# EAGLE design Schematic (EAGLE 9.5.2)
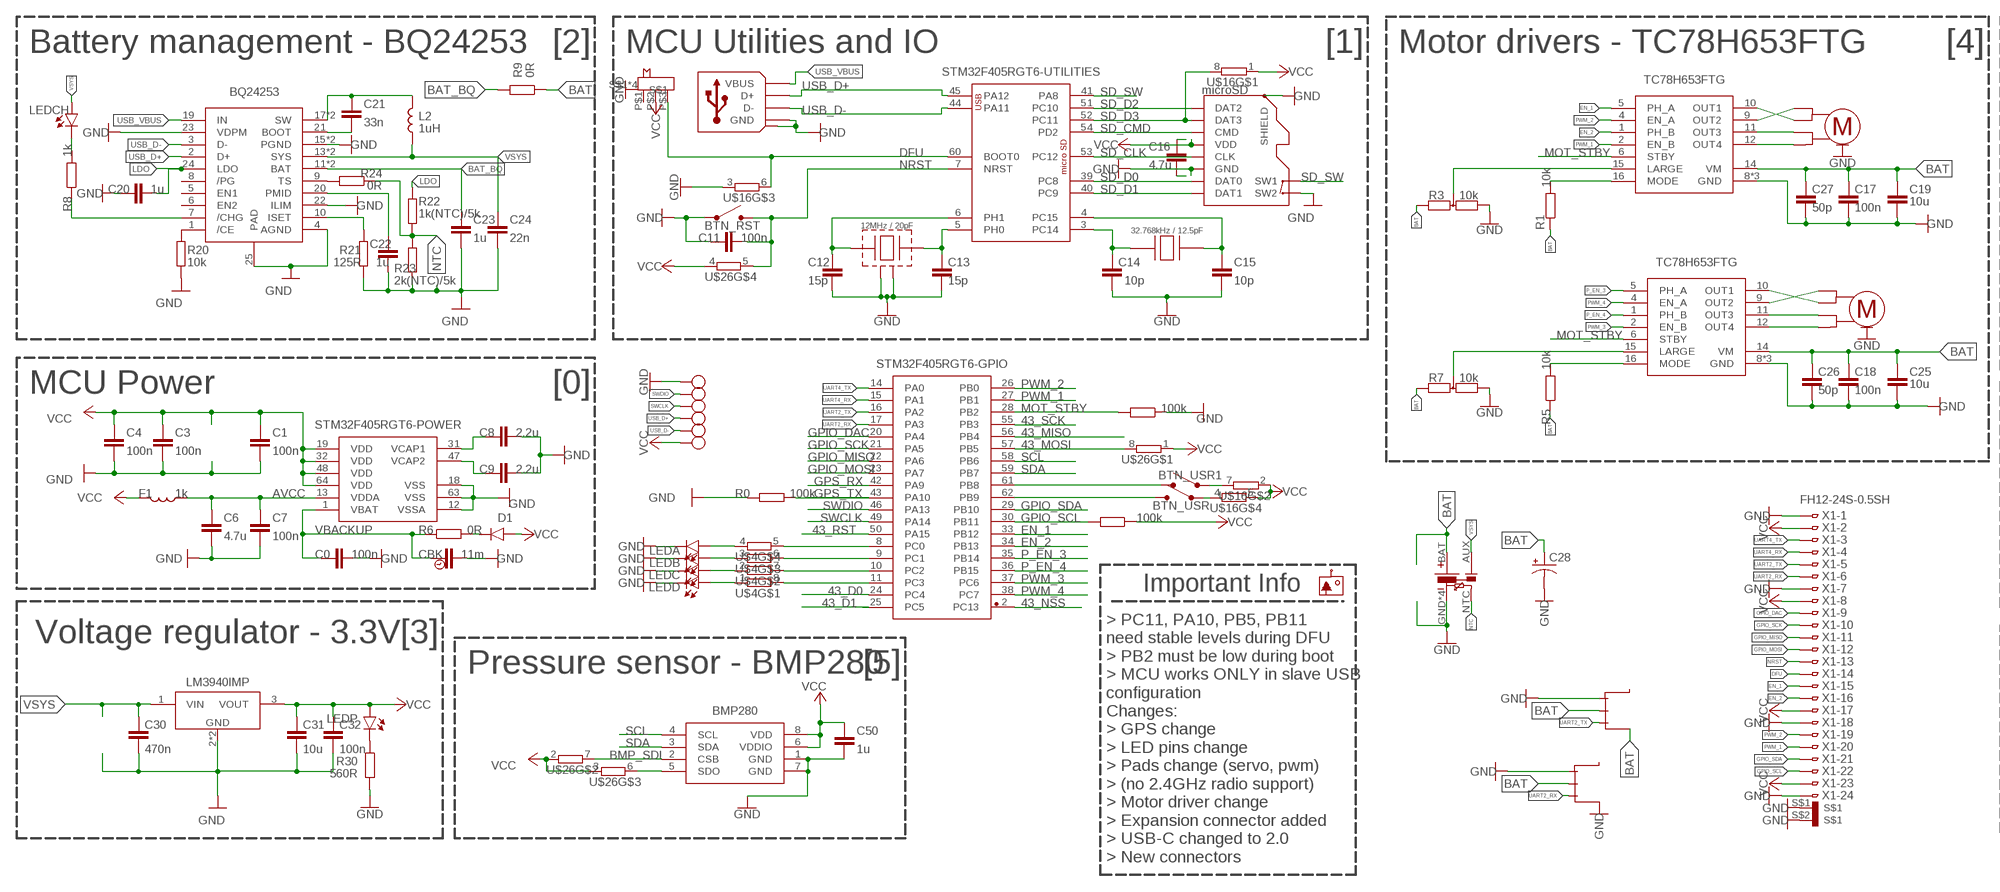
[diagram p0: schematic, sheet 1, part 1 of 2]
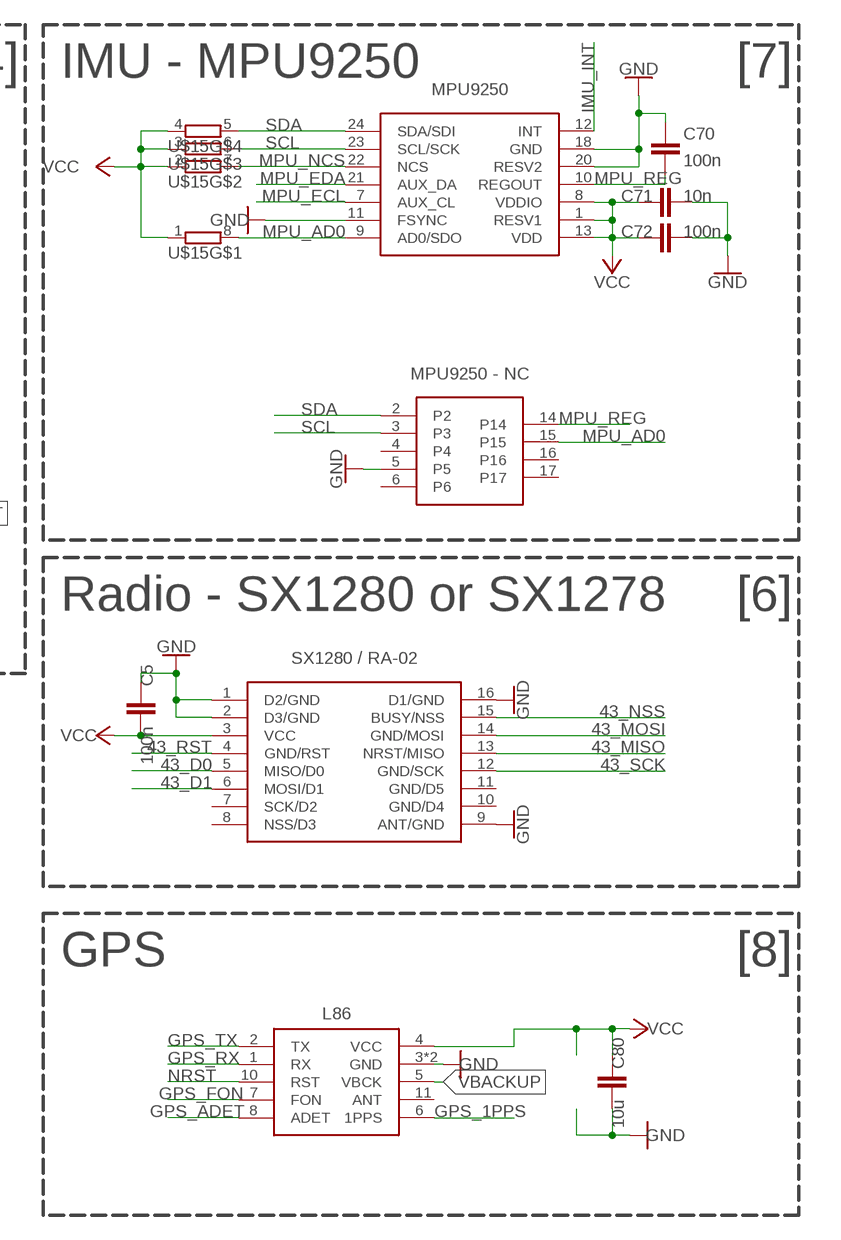
[diagram p1: schematic, sheet 1, part 2 of 2]

## Parts
BTN_DFU  SLIDE-SWITCH2  [SLIDE-SWITCH-2]
BTN_RST  PUSH-SWITCH  [SWITCH_SMD]
BTN_USR  PUSH-SWITCH  [SWITCH_SMD]
BTN_USR1  PUSH-SWITCH  [SWITCH_SMD]
C0  100n  CAPACITOR0603  [C0603]
C1  100n  CAPACITOR0603  [C0603]
C3  100n  CAPACITOR0603  [C0603]
C4  100n  CAPACITOR0603  [C0603]
C5  100n  CAPACITOR0603  [C0603]
C6  4.7u  CAPACITOR0603  [C0603]
C7  100n  CAPACITOR0603  [C0603]
C8  2.2u  CAPACITOR0603  [C0603]
C9  2.2u  CAPACITOR0603  [C0603]
C11  100n  CAPACITOR0603  [C0603]
C12  15p  CAPACITOR0603  [C0603]
C13  15p  CAPACITOR0603  [C0603]
C14  10p  CAPACITOR0603  [C0603]
C15  10p  CAPACITOR0603  [C0603]
C16  4.7u  CAPACITOR0603  [C0603]
C17  100n  CAPACITOR0603  [C0603]
C18  100n  CAPACITOR0603  [C0603]
C19  10u  CAPACITOR1206  [C1206]
C20  1u  CAPACITOR0603  [C0603]
C21  33n  CAPACITOR0603  [C0603]
C22  1u  CAPACITOR0603  [C0603]
C23  1u  CAPACITOR0603  [C0603]
C24  22n  CAPACITOR0603  [C0603]
C25  10u  CAPACITOR1206  [C1206]
C26  50p  CAPACITOR0603  [C0603]
C27  50p  CAPACITOR0603  [C0603]
C28  CPOL-US153CLV-0405  [153CLV-0405]
C30  470n  CAPACITOR0603  [C0603]
C31  10u  CAPACITOR1206  [C1206]
C32  100n  CAPACITOR0603  [C0603]
C50  1u  CAPACITOR0603  [C0603]
C70  100n  CAPACITOR0603  [C0603]
C71  10n  CAPACITOR0603  [C0603]
C72  100n  CAPACITOR0603  [C0603]
C80  10u  CAPACITOR0603  [C0603]
CBK  11m  SUPCAP  [CPH3225A]
D1  DIODE  [R0603]
F1  1k  INDUCTOR0603  [R0603]
L2  1uH  INDUCTOR  [INDUCTOR_VISHAY]
LEDA  LED0805  [CHIPLED_0805]
LEDB  LED0805  [CHIPLED_0805]
LEDC  LED0805  [CHIPLED_0805]
LEDCH  LED0805  [CHIPLED_0805]
LEDD  LED0805  [CHIPLED_0805]
LEDP  LED0805  [CHIPLED_0805]
LM3940IMP  REGULATOR  [SOT230P700X180-4N]
R0  100k  RESISTOR0603  [R0603]
R1  10k  RESISTOR0603  [R0603]
R2  100k  RESISTOR0603  [R0603]
R3  10k  DOUBLE_RESISTOR  [DR0603]
R4  100k  RESISTOR0603  [R0603]
R5  10k  RESISTOR0603  [R0603]
R6  0R  RESISTOR0603  [R0603]
R7  10k  DOUBLE_RESISTOR  [DR0603]
R8  1k  RESISTOR0603  [R0603]
R9  0R  RESISTOR0603  [R0603]
R20  10k  RESISTOR0603  [R0603]
R21  125R  RESISTOR0603  [R0603]
R22  1k(NTC)/5k  RESISTOR0603  [R0603]
R23  2k(NTC)/5k  RESISTOR0603  [R0603]
R24  0R  RESISTOR0603  [R0603]
R30  560R  RESISTOR0603  [R0603]
U$1  STM32F405RGT6  [QFP50P1200X1200X160-64N]
U$2  MICROSD_HOLDER  [MICROSD_HOLDER]
U$3  L86  [L86]
U$4  RESISTORARRAY  [0603-ARC]
U$5  32.768kHz / 12.5pF  OSCILLATOR_2PIN32X15  [OSC32X15]
U$6  12MHz / 20pF  OSCILLATOR_4PIN32X25  [OSCCC320X250X80N]
U$7  USB2.0  [USB-C(2)]
U$8  BMP280  [BMP280]
U$9  MPU9250USR  [MPU9250]
U$10  BQ24253  [QFN50P400X400X100-25T270N]
U$11  TC78H653FTG  [QFN50P300X300X90-17T170N]
U$12  TC78H653FTG  [QFN50P300X300X90-17T170N]
U$13  MOTOR_DUO  [4(2)X_JSTSMD_F]
U$14  BAT_JST_4(3)  [4(3)X_JSTSMD_F]
U$15  RESISTORARRAY  [0603-ARC]
U$16  RESISTORARRAY  [0603-ARC]
U$17  MOTOR_DUO  [4(2)X_JSTSMD_F]
U$18  LOGOSQSM  [LOGOSQSM]
U$19  CONNECTOR_F_X3_JST_SMD  [3X_JSTSMD_F]
U$20  CONNECTOR_F_X3_JST_SMD  [3X_JSTSMD_F]
U$21  LORADUO  [MODULE_SX1280]
U$25  GPIO_DEBUG  [GPIO_DEBUG]
U$26  RESISTORARRAY  [0603-ARC]
X1  FH12-24S-0.5SH  [FH12-24S-0.5SH]

## Nets
43_D0: U$1.24(STM32F405RGT6_GPIO:PC4) U$21.5(MISO/D0)
43_D1: U$1.25(STM32F405RGT6_GPIO:PC5) U$21.6(MOSI/D1)
43_MISO: U$1.56(STM32F405RGT6_GPIO:PB4) U$21.13(NRST/MISO)
43_MOSI: U$1.57(STM32F405RGT6_GPIO:PB5) U$21.14(GND/MOSI) U$26.8
43_NSS: U$1.2(STM32F405RGT6_GPIO:PC13) U$21.15(BUSY/NSS)
43_RST: U$1.50(STM32F405RGT6_GPIO:PA15) U$21.4(GND/RST)
43_SCK: U$1.55(STM32F405RGT6_GPIO:PB3) U$21.12(GND/SCK)
AVCC: C6.1 C7.1 F1.2 U$1.13(STM32F405RGT6_PWR:VDDA)
BAT: C17.1 C18.1 C19.1 C25.1 C26.1 C27.1 C28.+ R1.1 R3.2 R5.1 R7.2 R9.1 U$11.14(VM) U$12.14(VM) U$14.BAT(+) U$19.P$2 U$19.S$1 U$19.S$2(S$1) U$20.P$2
BAT_BQ: C23.1 R9.2 U$10.11(BAT) U$10.12(BAT)
BMP_SDI: U$8.2(CSB) U$26.7
BMP_SDO: U$8.5(SDO) U$26.6
DFU: BTN_DFU.P$3 U$1.60(STM32F405RGT6_UTL:BOOT0) U$16.6 X1.14
EN_1: U$1.33(STM32F405RGT6_GPIO:PB12) U$12.5(PH_A) X1.15
EN_2: U$1.34(STM32F405RGT6_GPIO:PB13) U$12.1(PH_B) X1.16
GND: BTN_DFU.S$1 BTN_DFU.S$2(S$1) BTN_DFU.S$3(S$1) BTN_DFU.S$4(S$1) BTN_RST.P$1 BTN_RST.P$4 C0.2 C1.2 C3.2 C4.2 C5.1 C6.2 C7.2 C8.2 C9.2 C11.1 C12.2 C13.2 C14.2 C15.2 C16.1 C17.2 C18.2 C19.2 C20.1 C22.2 C23.2 C24.2 C25.2 C26.2 C27.2 C28.- C30.2 C31.2 C32.2 C50.2 C70.1 C71.2 C72.2 C80.2 CBK.P$2 LEDA.C LEDB.C LEDC.C LEDD.C LM3940IMP.2(GND) LM3940IMP.4(GND) R0.1 R2.1 R3.3 R7.3 R20.1 R21.1 R23.1 R30.2 U$1.12(STM32F405RGT6_PWR:VSSA) U$1.18(STM32F405RGT6_PWR:VSS) U$1.63(STM32F405RGT6_PWR:VSS) U$2.GND U$2.SHIELD@1(SHIELD) U$2.SHIELD@2(SHIELD) U$2.SHIELD@3(SHIELD) U$2.SHIELD@4(SHIELD) U$2.SW2 U$3.3(GND) U$3.12(GND) U$6.2(GND) U$6.4(GND) U$7.A1(GND) U$7.A12(GND) U$7.B1(GND) U$7.B12(GND) U$7.MID@1(SHIELD) U$7.MID@2(SHIELD) U$7.S$1(GND) U$7.S$2(GND) U$7.S$3(GND) U$7.S$4(GND) U$7.S$5(GND) U$7.S$6(GND) U$7.S$7(GND) U$7.S$8(GND) U$8.1(GND) U$8.7(GND) U$9.5 U$9.11(FSYNC) U$9.18(GND) U$9.20(RESV2) U$10.4(AGND) U$10.15(PGND) U$10.16(PGND) U$10.22(ILIM) U$10.23(VDPM) U$10.25(PAD) U$11.8(GND) U$11.13(GND) U$11.17(GND) U$12.8(GND) U$12.13(GND) U$12.17(GND) U$13.S$1 U$13.S$2(S$1) U$13.S$3(S$1) U$13.S$4(S$1) U$14.GND(-) U$14.S$1(-) U$14.S$2(-) U$14.S$3(-) U$16.3 U$17.S$1 U$17.S$2(S$1) U$17.S$3(S$1) U$17.S$4(S$1) U$19.P$1 U$20.P$1 U$20.S$1 U$20.S$2(S$1) U$21.1(D2/GND) U$21.2(D3/GND) U$21.9(ANT/GND) U$21.16(D1/GND) U$25.P$1 X1.1 X1.7 X1.18 X1.24 X1.S$1 X1.S$2
GPIO_DAC: U$1.20(STM32F405RGT6_GPIO:PA4) X1.9
GPIO_MISO: U$1.22(STM32F405RGT6_GPIO:PA6) X1.11
GPIO_MOSI: U$1.23(STM32F405RGT6_GPIO:PA7) X1.12
GPIO_SCK: U$1.21(STM32F405RGT6_GPIO:PA5) X1.10
GPIO_SCL: R4.2 U$1.30(STM32F405RGT6_GPIO:PB11) X1.22
GPIO_SDA: U$1.29(STM32F405RGT6_GPIO:PB10) X1.21
GPS_1PPS: U$3.6(1PPS)
GPS_ADET: U$3.8(ADET)
GPS_FON: U$3.7(FON)
GPS_RX: U$1.42(STM32F405RGT6_GPIO:PA9) U$3.1(RX)
GPS_TX: R0.2 U$1.43(STM32F405RGT6_GPIO:PA10) U$3.2(TX)
IMU_INT: U$9.12(INT)
LDO: C20.2 R22.2 U$10.24(LDO)
MOT_STBY: R2.2 U$1.28(STM32F405RGT6_GPIO:PB2) U$11.6(STBY) U$12.6(STBY)
MPU_AD0: U$9.9(AD0/SDO) U$9.15 U$15.8
MPU_ECL: U$9.7(AUX_CL)
MPU_EDA: U$9.21(AUX_DA)
MPU_NCS: U$9.22(NCS) U$15.7
MPU_REG: C70.2 U$9.10(REGOUT) U$9.14
N$1: LEDD.A U$4.1
N$2: LEDC.A U$4.2
N$3: LEDCH.C R8.2
N$4: U$11.9(OUT2) U$13.P$1
N$5: BTN_USR.P$2 BTN_USR.P$3 U$1.62(STM32F405RGT6_GPIO:PB9)
N$6: C21.2 U$10.21(BOOT)
N$7: BTN_USR.P$1 BTN_USR.P$4 U$16.4
N$8: C9.1 U$1.47(STM32F405RGT6_PWR:VCAP2)
N$9: C8.1 U$1.31(STM32F405RGT6_PWR:VCAP1)
N$10: R8.1 U$10.7(/CHG)
N$11: C12.1 U$1.6(STM32F405RGT6_UTL:PH1) U$6.1
N$12: C13.1 U$1.5(STM32F405RGT6_UTL:PH0) U$6.3
N$13: C14.1 U$1.3(STM32F405RGT6_UTL:PC14) U$5.P$1
N$14: C15.1 U$1.4(STM32F405RGT6_UTL:PC15) U$5.P$2
N$15: U$1.8(STM32F405RGT6_GPIO:PC0) U$4.5
N$17: R24.2 U$10.9(TS)
N$18: R21.2 U$10.10(ISET)
N$19: U$1.11(STM32F405RGT6_GPIO:PC3) U$4.8
N$20: U$1.10(STM32F405RGT6_GPIO:PC2) U$4.7
N$21: C21.1 L2.P$1 U$10.17(SW) U$10.18(SW)
N$22: LEDP.C R30.1
N$23: U$11.10(OUT1) U$13.P$2
N$24: C22.1 U$10.20(PMID)
N$25: BTN_USR1.P$1 BTN_USR1.P$4 U$16.7
N$26: U$1.9(STM32F405RGT6_GPIO:PC1) U$4.6
N$27: R20.2 U$10.1(/CE)
N$28: BTN_USR1.P$2 BTN_USR1.P$3 U$1.61(STM32F405RGT6_GPIO:PB8)
N$29: U$11.11(OUT3) U$13.P$3
N$30: U$11.12(OUT4) U$13.P$4
N$31: U$12.9(OUT2) U$17.P$1
N$33: U$12.10(OUT1) U$17.P$2
N$34: U$12.11(OUT3) U$17.P$3
N$35: U$12.12(OUT4) U$17.P$4
N$36: R1.2 U$12.16(MODE)
N$37: LEDB.A U$4.3
N$38: LEDA.A U$4.4
N$39: R3.1 U$12.15(LARGE)
N$40: R5.2 U$11.16(MODE)
N$41: D1.2 R6.2
N$42: R7.1 U$11.15(LARGE)
NRST: BTN_RST.P$2 BTN_RST.P$3 C11.2 U$1.7(STM32F405RGT6_UTL:NRST) U$3.10(RST) U$26.5 X1.13
NTC: R22.1 R23.2 R24.1 U$14.NTC
P_EN_3: U$1.35(STM32F405RGT6_GPIO:PB14) U$11.5(PH_A)
P_EN_4: U$1.36(STM32F405RGT6_GPIO:PB15) U$11.1(PH_B)
PWM_1: U$1.27(STM32F405RGT6_GPIO:PB1) U$12.2(EN_B) X1.20
PWM_2: U$1.26(STM32F405RGT6_GPIO:PB0) U$12.4(EN_A) X1.19
PWM_3: U$1.37(STM32F405RGT6_GPIO:PC6) U$11.2(EN_B)
PWM_4: U$1.38(STM32F405RGT6_GPIO:PC7) U$11.4(EN_A)
SCL: U$1.58(STM32F405RGT6_GPIO:PB6) U$8.4(SCL) U$9.3 U$9.23(SCL/SCK) U$15.6
SD_CLK: U$1.53(STM32F405RGT6_UTL:PC12) U$2.CLK
SD_CMD: U$1.54(STM32F405RGT6_UTL:PD2) U$2.CMD
SD_D0: U$1.39(STM32F405RGT6_UTL:PC8) U$2.D0(DAT0)
SD_D1: U$1.40(STM32F405RGT6_UTL:PC9) U$2.D1(DAT1)
SD_D2: U$1.51(STM32F405RGT6_UTL:PC10) U$2.D2(DAT2)
SD_D3: U$1.52(STM32F405RGT6_UTL:PC11) U$2.D3(DAT3) U$16.8
SD_SW: U$1.41(STM32F405RGT6_UTL:PA8) U$2.SW1
SDA: U$1.59(STM32F405RGT6_GPIO:PB7) U$8.3(SDA) U$9.2 U$9.24(SDA/SDI) U$15.5
SWCLK: U$1.49(STM32F405RGT6_GPIO:PA14) U$25.P$3
SWDIO: U$1.46(STM32F405RGT6_GPIO:PA13) U$25.P$2
UART2_RX: U$1.17(STM32F405RGT6_GPIO:PA3) U$20.P$3 X1.6
UART2_TX: U$1.16(STM32F405RGT6_GPIO:PA2) U$19.P$3 X1.5
UART4_RX: U$1.15(STM32F405RGT6_GPIO:PA1) X1.4
UART4_TX: U$1.14(STM32F405RGT6_GPIO:PA0) X1.3
USB_D+: U$1.45(STM32F405RGT6_UTL:PA12) U$7.A6(D+) U$7.B6(D+) U$10.2(D+) U$25.P$4
USB_D-: U$1.44(STM32F405RGT6_UTL:PA11) U$7.A7(D-) U$7.B7(D-) U$10.3(D-) U$25.P$5
USB_VBUS: U$7.A4(VBUS) U$7.A9(VBUS) U$7.B4(VBUS) U$7.B9(VBUS) U$10.19(IN)
VBACKUP: C0.1 CBK.P$1 R6.1 U$1.1(STM32F405RGT6_PWR:VBAT) U$3.5(VBCK)
VCC: BTN_DFU.P$2 C1.1 C3.1 C4.1 C5.2 C16.2 C31.1 C32.1 C50.1 C71.1 C72.1 C80.1 D1.1 F1.1 LEDP.A LM3940IMP.3(VOUT) R4.1 U$1.19(STM32F405RGT6_PWR:VDD) U$1.32(STM32F405RGT6_PWR:VDD) U$1.48(STM32F405RGT6_PWR:VDD) U$1.64(STM32F405RGT6_PWR:VDD) U$2.VCC(VDD) U$3.4(VCC) U$8.6(VDDIO) U$8.8(VDD) U$9.1(RESV1) U$9.8(VDDIO) U$9.13(VDD) U$15.1 U$15.2 U$15.3 U$15.4 U$16.1 U$16.2 U$16.5 U$21.3(VCC) U$25.P$6 U$26.1 U$26.2 U$26.3 U$26.4 X1.2 X1.8 X1.17 X1.23
VSYS: C24.1 C30.1 L2.P$2 LEDCH.A LM3940IMP.1(VIN) U$10.13(SYS) U$10.14(SYS) U$14.AUX(AUX+)
Unconnected: BTN_DFU.P$1 U$3.11(ANT) U$9.4 U$9.6 U$9.16 U$9.17 U$10.5(EN1) U$10.6(EN2) U$10.8(/PG) U$21.7(SCK/D2) U$21.8(NSS/D3) U$21.10(GND/D4) U$21.11(GND/D5)

## Notes on the sheet
- Battery management - BQ24253 | [2] | MCU Utilities and IO | [1] | Motor drivers - TC78H653FTG | [4] | IMU - MPU9250 | [7]
- MCU Power | [0]
- Radio - SX1280 or SX1278 | [6]
- Important Info
- > PC11, PA10, PB5, PB11
  need stable levels during DFU
  > PB2 must be low during boot
  > MCU works ONLY in slave USB
  configuration
- Voltage regulator - 3.3V | [3]
- GPS | [8]
- Pressure sensor - BMP280 | [5]
- Changes:
  > GPS change
  > LED pins change
  > Pads change (servo, pwm)
  > (no 2.4GHz radio support)
  > Motor driver change
  > Expansion connector added
  > USB-C changed to 2.0
  > New connectors

## Library data of the parts
BTN_DFU = SobieskiSat2:SLIDE-SWITCH
BTN_RST BTN_USR BTN_USR1 = SobieskiSat2:PUSH-SWITCH
C0 C1 C3-C9 C11-C27 C30-C32 C50 C70-C72 C80 = Unified:CAPACITOR
C28 = rcl:CPOL-US: POLARIZED CAPACITOR, American symbol; SPICEPREFIX: C
CBK = SobieskiSat2:SUPCAP
D1 = Unified:DIODE
F1 = Unified:INDUCTOR
L2 = SobieskiSat2:INDUCTOR
LEDA LEDB LEDC LEDCH LEDD LEDP = Unified:LED
LM3940IMP = Unified:REGULATOR
R0 R1 R2 R4-R6 R8 R9 R20-R24 R30 = Unified:RESISTOR
R3 R7 = SobieskiSat2:DOUBLE_RESISTOR
U$1 = SobieskiSat2:STM32F405RGT6
U$2 = SobieskiSat2:MICROSD_HOLDER: https://www.molex.com/molex/products/datasheet.jsp?part=active/5033981892_MEMORY_CARD_SOCKET.xml&channel=Products&Lang=en-US
U$3 = SobieskiSat2:L86
U$4 U$15 U$16 U$26 = SobieskiSat2:RESISTORARRAY
U$5 = SobieskiSat2:OSCILLATOR_2PIN
U$6 = SobieskiSat2:OSCILLATOR_4PIN
U$7 = SobieskiSat2:USB
U$8 = SobieskiSat2:BMP280
U$9 = SobieskiSat2:MPU9250
U$10 = SobieskiSat2:BQ24253
U$11 U$12 = SobieskiSat2:TC78H653FTG
U$13 U$17 = SobieskiSat2:MOTOR_DUO
U$14 = SobieskiSat2:BAT_JST_4(3)
U$18 = SobieskiSat2:LOGO
U$19 U$20 = Unified:CONNECTOR_F_X3
U$21 = SobieskiSat2:LORADUO
U$25 = SobieskiSat2:GPIO_DEBUG
X1 = SobieskiSat2:FH12-24S-0.5S: 0.5mm Pitch Connectors For FPC/FFC Source: Data sheet <http://www.hirose.co.jp/cataloge_hp/e58605370.pdf>; MPN: FH12-24S-0.5SH(55); OC_FARNELL: 1324552; OC_NEWARK: 34M6170

## Board
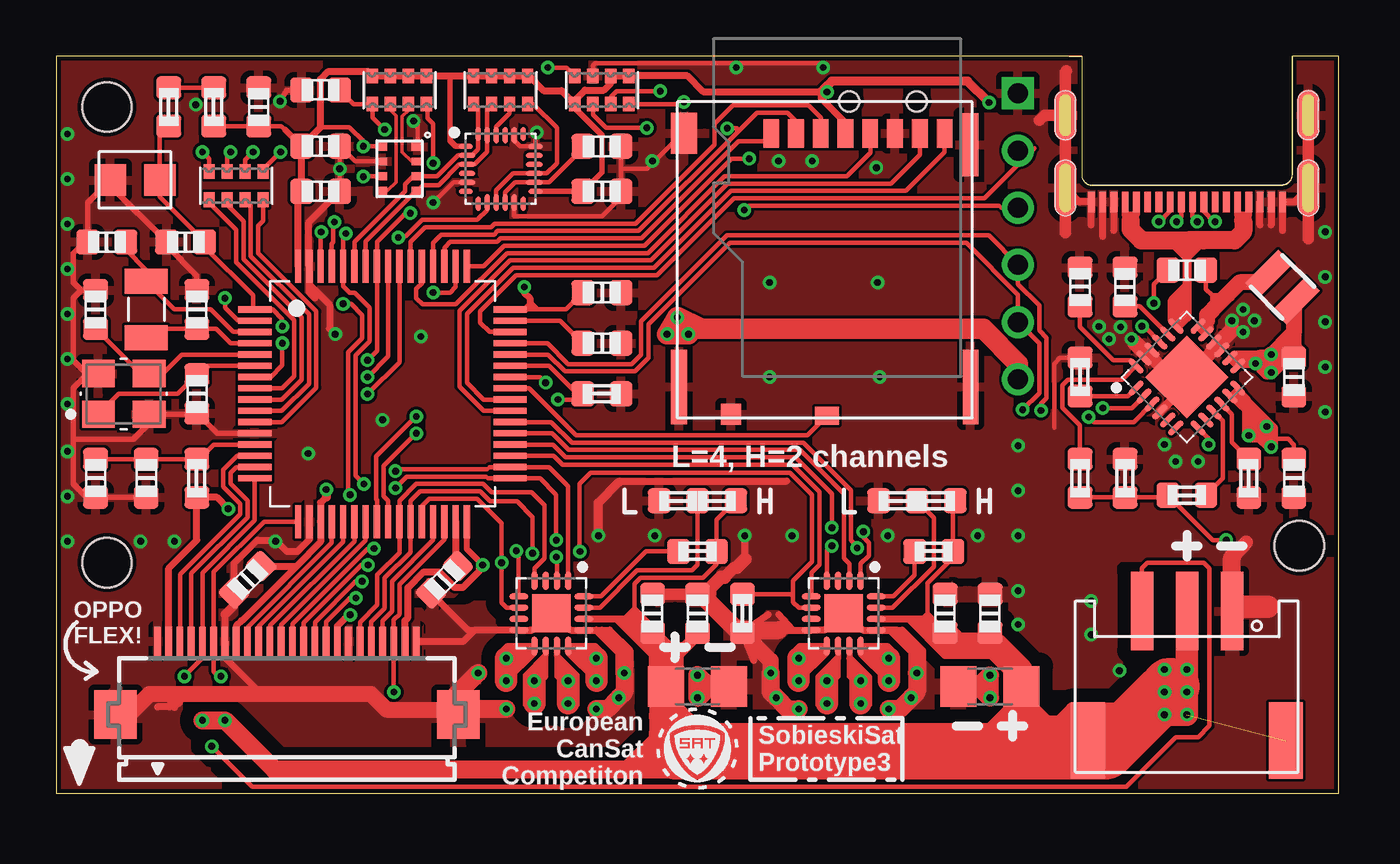
[diagram p2: board, top side]
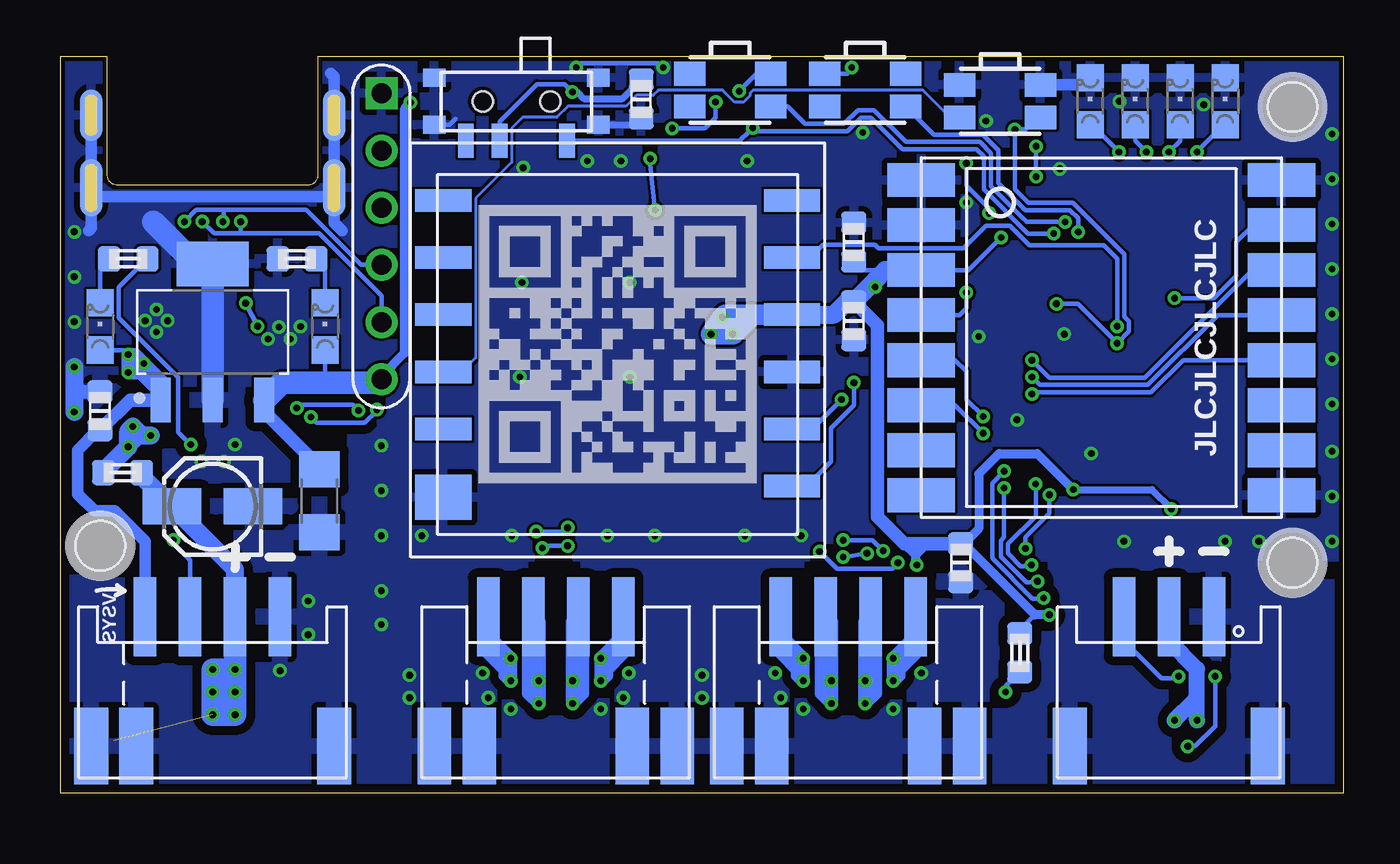
[diagram p3: board, bottom side, seen from below]

Size 57 x 32.75 mm. Coordinates in mm from the lower left corner, seen from the top.
Outline: 54.45,27.02 46,27.02 arc-84 45.58,27.45 45.58,32.75 0,32.75 0,0 57,0 57,32.75 54.92,32.75 54.92,27.48 arc-97 54.45,27.02
Outline: 54.45,27.02 54.48,27.02
Copper layers (1*16): Top 0.035mm / dielectric 1.2mm / Bottom 0.035mm
Design rules "jlcpcb_2layers *": minimum track width 5mil, minimum drill 0.3mm, track to track 5mil, track to pad 5mil, pad to pad 5mil, via to via 5mil, smd to smd 5mil, copper to edge 0.2mm, drill to drill 6mil, minimum pad ring 3mil, minimum via ring 0.15mm, stop-mask expansion 4mil, vias tented up to drill 0.35mm, thermal gap 10mil
Holes 2.2 mm at 2.25,30.5 55.25,11 2.25,10.25
tRestrict: area 2.7,18 to 3.3,19; area 2.7,16.1 to 3.3,17.4; area 48.3,16.6 to 52.2,20.5; area 51.1,19.4 to 52.1,20.4; area 48,19 to 49,20

### Footprints (pad centres in the part's own frame; a part is rotated, then mirrored left to right if it is on the bottom)
SLIDE-SWITCH-2 = smd 0.7 x 1.5: P$1 -2.25,-1.75; P$2 -0.75,-1.75; P$3 2.25,-1.75 | smd 1 x 0.8: S$1 -3.65,1.05; S$2 3.65,1.05; S$3 -3.65,-1.05; S$4 3.65,-1.05 | hole 0.9: -1.5,0; 1.5,0
SWITCH_SMD = smd 1.4 x 1.05: P$1 -1.8,0.725; P$2 -1.8,-0.725; P$3 1.8,-0.725; P$4 1.8,0.725
C0603 = smd 1 x 1.1: 1 -0.85,0; 2 0.85,0
C1206 = smd 1.6 x 1.8: 1 -1.4,0; 2 1.4,0
153CLV-0405 = smd 2.6 x 1.6: + 1.8,0; - -1.8,0
CPH3225A = smd 1.4 x 1.4: P$1 -1.1,0; P$2 1.1,0
R0603 = smd 1 x 1.1: 1 -0.85,0; 2 0.85,0
INDUCTOR_VISHAY = smd 0.9 x 2.1: P$1 -0.85,0; P$2 0.85,0
CHIPLED_0805 = smd 1.2 x 1.2: A 0,-1.05; C 0,1.05
SOT230P700X180-4N = smd 1.965 x 0.889: 1 -3.023,2.3; 2 -3.023,0; 3 -3.023,-2.3 | smd 1.965 x 3.189: 4 3.023,0
DR0603 = smd 1 x 1.1: 1 0,0; 2 1.7,0; 3 -1.7,0
QFP50P1200X1200X160-64N = smd 1.469 x 0.28: 1 -5.671,3.75; 2 -5.671,3.25; 3 -5.671,2.75; 4 -5.671,2.25; 5 -5.671,1.75; 6 -5.671,1.25; 7 -5.671,0.75; 8 -5.671,0.25; 9 -5.671,-0.25; 10 -5.671,-0.75; 11 -5.671,-1.25; 12 -5.671,-1.75; 13 -5.671,-2.25; 14 -5.671,-2.75; 15 -5.671,-3.25; 16 -5.671,-3.75; 33 5.671,-3.75; 34 5.671,-3.25; 35 5.671,-2.75; 36 5.671,-2.25; 37 5.671,-1.75; 38 5.671,-1.25; 39 5.671,-0.75; 40 5.671,-0.25; 41 5.671,0.25; 42 5.671,0.75; 43 5.671,1.25; 44 5.671,1.75; 45 5.671,2.25; 46 5.671,2.75; 47 5.671,3.25; 48 5.671,3.75 | smd 0.28 x 1.469: 17 -3.75,-5.671; 18 -3.25,-5.671; 19 -2.75,-5.671; 20 -2.25,-5.671; 21 -1.75,-5.671; 22 -1.25,-5.671; 23 -0.75,-5.671; 24 -0.25,-5.671; 25 0.25,-5.671; 26 0.75,-5.671; 27 1.25,-5.671; 28 1.75,-5.671; 29 2.25,-5.671; 30 2.75,-5.671; 31 3.25,-5.671; 32 3.75,-5.671; 49 3.75,5.671; 50 3.25,5.671; 51 2.75,5.671; 52 2.25,5.671; 53 1.75,5.671; 54 1.25,5.671; 55 0.75,5.671; 56 0.25,5.671; 57 -0.25,5.671; 58 -0.75,5.671; 59 -1.25,5.671; 60 -1.75,5.671; 61 -2.25,5.671; 62 -2.75,5.671; 63 -3.25,5.671; 64 -3.75,5.671
MICROSD_HOLDER = smd 0.7 x 1.27: CLK 2.02,6; CMD -0.18,6; D0 4.22,6; D1 5.32,6; D2 -2.38,6; D3 -1.28,6; GND 3.12,6; VCC 0.92,6 | smd 0.7 x 3.33: SHIELD@1 6.48,-5.263; SHIELD@3 -6.48,-5.263 | smd 0.86 x 2.8: SHIELD@2 6.4,5.5 | smd 1.14 x 1.83: SHIELD@4 -6.26,6.015 | smd 1.05 x 0.78: SW1 0.095,-6.54 | smd 0.9 x 0.93: SW2 -4.17,-6.465
L86 = smd 2.5 x 1: 1 -7.75,5.85; 2 -7.75,3.31; 3 -7.75,0.77; 4 -7.75,-1.77; 5 -7.75,-4.31; 6 -7.75,-6.85; 7 7.75,-6.85; 8 7.75,-4.31; 9 7.75,-1.77; 10 7.75,0.77; 11 7.75,3.31 | smd 2.5 x 2: 12 7.75,6.35
0603-ARC = smd 0.5 x 0.65: 1 -1.2,-0.625; 2 -0.4,-0.625; 3 0.4,-0.625; 4 1.2,-0.625; 5 1.2,0.625; 6 0.4,0.625; 7 -0.4,0.625; 8 -1.2,0.625
OSC32X15 = smd 1.1 x 1.9: P$1 -1.25,0; P$2 1.25,0
OSCCC320X250X80N = smd 1.462 x 1.212: 1 -1.125,-0.9; 2 1.125,-0.9; 3 1.125,0.9; 4 -1.125,0.9
USB-C(2) = smd 0.3 x 0.9: A1 -3.75,3.85; A4 -2.75,3.85; A5 -1.75,3.85; A6 -0.75,3.85; A7 0.75,3.85; A8 1.75,3.85; A9 2.75,3.85; A12 3.75,3.85; B1 3.25,3.85; B4 2.25,3.85; B5 1.25,3.85; B6 0.25,3.85; B7 -0.25,3.85; B8 -1.25,3.85; B9 -2.25,3.85; B12 -3.25,3.85; MID@1 -4.25,3.85; MID@2 4.25,3.85 | smd 1 x 2.3 bottom: S$1 -5.4,0; S$2 5.4,0 | smd 1 x 2.55 bottom: S$3 -5.4,3.23; S$4 5.4,3.23 | smd 1 x 2.3: S$5 -5.4,0; S$6 5.4,0 | smd 1 x 2.55: S$7 -5.4,3.23; S$8 5.4,3.23
BMP280 = smd 0.5 x 0.35: 1 0.8,0.975; 2 0.8,0.325; 3 0.8,-0.325; 4 0.8,-0.975; 5 -0.8,-0.975; 6 -0.8,-0.325; 7 -0.8,0.325; 8 -0.8,0.975
MPU9250 = smd 0.638 x 0.22: 1 -1.546,1; 6 -1.546,-1; 13 1.546,-1; 18 1.546,1 | smd 0.738 x 0.22: 2 -1.496,0.6; 3 -1.496,0.2; 4 -1.496,-0.2; 5 -1.496,-0.6; 14 1.496,-0.6; 15 1.496,-0.2; 16 1.496,0.2; 17 1.496,0.6 | smd 0.22 x 0.638: 7 -1,-1.546; 12 1,-1.546; 19 1,1.546; 24 -1,1.546 | smd 0.22 x 0.738: 8 -0.6,-1.496; 9 -0.2,-1.496; 10 0.2,-1.496; 11 0.6,-1.496; 20 0.6,1.496; 21 0.2,1.496; 22 -0.2,1.496; 23 -0.6,1.496
QFN50P400X400X100-25T270N = smd 0.84 x 0.264: 1 -1.945,1.25; 2 -1.945,0.75; 3 -1.945,0.25; 4 -1.945,-0.25; 5 -1.945,-0.75; 6 -1.945,-1.25; 13 1.945,-1.25; 14 1.945,-0.75; 15 1.945,-0.25; 16 1.945,0.25; 17 1.945,0.75; 18 1.945,1.25 | smd 0.264 x 0.84: 7 -1.25,-1.945; 8 -0.75,-1.945; 9 -0.25,-1.945; 10 0.25,-1.945; 11 0.75,-1.945; 12 1.25,-1.945; 19 1.25,1.945; 20 0.75,1.945; 21 0.25,1.945; 22 -0.25,1.945; 23 -0.75,1.945; 24 -1.25,1.945 | smd 2.6 x 2.6: 25 0,0
QFN50P300X300X90-17T170N = smd 0.838 x 0.27: 1 -1.446,0.75; 2 -1.446,0.25; 3 -1.446,-0.25; 4 -1.446,-0.75; 9 1.446,-0.75; 10 1.446,-0.25; 11 1.446,0.25; 12 1.446,0.75 | smd 0.27 x 0.838: 5 -0.75,-1.446; 6 -0.25,-1.446; 7 0.25,-1.446; 8 0.75,-1.446; 13 0.75,1.446; 14 0.25,1.446; 15 -0.25,1.446; 16 -0.75,1.446 | smd 1.7 x 1.7: 17 0,0
4(2)X_JSTSMD_F = smd 1 x 3.5: P$1 -3,-3.35; P$2 -1,-3.35; P$3 1,-3.35; P$4 3,-3.35 | smd 1.5 x 3.4: S$1 -3.4,2.4; S$2 3.4,2.4; S$3 -5.4,2.4; S$4 5.4,2.4
4(3)X_JSTSMD_F = smd 1 x 3.5: AUX 3,-3.35; BAT -1,-3.35; GND -3,-3.35; NTC 1,-3.35 | smd 1.5 x 3.4: S$1 -5.4,2.4; S$2 5.4,2.4; S$3 3.4,2.4
3X_JSTSMD_F = smd 1 x 3.5: P$1 -2,-3.35; P$2 0,-3.35; P$3 2,-3.35 | smd 1.5 x 3.4: S$1 -4.4,2.4; S$2 4.4,2.4
MODULE_SX1280 = smd 3 x 1.5: 1 -8,7; 2 -8,5; 3 -8,3; 4 -8,1; 5 -8,-1; 6 -8,-3; 7 -8,-5; 8 -8,-7; 9 8,-7; 10 8,-5; 11 8,-3; 12 8,-1; 13 8,1; 14 8,3; 15 8,5; 16 8,7
GPIO_DEBUG = drill 0.889 pad 1.422 square: P$1 0,6.35 | drill 0.889 pad 1.422: P$2 0,3.81; P$3 0,1.27; P$4 0,-1.27; P$5 0,-3.81; P$6 0,-6.35
FH12-24S-0.5SH = smd 0.3 x 1.3: 1 -5.75,3.25; 2 -5.25,3.25; 3 -4.75,3.25; 4 -4.25,3.25; 5 -3.75,3.25; 6 -3.25,3.25; 7 -2.75,3.25; 8 -2.25,3.25; 9 -1.75,3.25; 10 -1.25,3.25; 11 -0.75,3.25; 12 -0.25,3.25; 13 0.25,3.25; 14 0.75,3.25; 15 1.25,3.25; 16 1.75,3.25; 17 2.25,3.25; 18 2.75,3.25; 19 3.25,3.25; 20 3.75,3.25; 21 4.25,3.25; 22 4.75,3.25; 23 5.25,3.25; 24 5.75,3.25 | smd 1.905 x 2.159: S$1 -7.62,0; S$2 7.62,0

### Placement (x,y rotation side)
BTN_DFU  36.75,30.75 0 bottom
BTN_RST  15.25,30.75 0 bottom
BTN_USR  21.25,31.25 0 bottom
BTN_USR1  27.25,31.25 0 bottom
C0  5.75,24.5 180 top
C1  8.5,9.5 225 top
C3  24.25,22.25 0 top
C4  11.75,26.75 0 top
C5  21.75,21 90 bottom
C6  4,14 270 top
C7  1.75,14 270 top
C8  17.25,9.5 225 top
C9  24.25,20 0 top
C11  11.75,31.25 0 top
C12  6.25,17.75 270 top
C13  1.75,21.5 90 top
C14  2.25,24.5 180 top
C15  6.25,21.5 90 top
C16  31.2,30.85 90 bottom
C17  28.5,8 90 top
C18  41.5,8 90 top
C19  28.5,4.75 0 top
C20  45.5,22.5 270 top
C21  50.25,23.25 180 top
C22  47.5,22.5 90 top
C23  55,14 270 top
C24  55,18.5 270 top
C25  41.5,4.75 180 top
C26  39.5,8 90 top
C27  26.5,8 90 top
C28  50.25,12.75 180 bottom
C30  55.25,17 90 bottom
C31  45.5,13 270 bottom
C32  17,10.25 270 bottom
C50  11.75,28.75 0 top
C70  24.25,28.75 180 top
C71  21.75,24.5 90 bottom
C72  24.25,26.75 0 top
C80  9,30.5 90 top
CBK  3.5,27.25 180 top
D1  7,30.5 90 top
F1  6.25,14 90 top
L2  54.5,22.5 315 top
LEDA  5.25,30.75 0 bottom
LEDB  7.25,30.75 0 bottom
LEDC  9.25,30.75 0 bottom
LEDCH  55.25,20.75 0 bottom
LEDD  11.25,30.75 0 bottom
LEDP  45.25,20.75 0 bottom
LM3940IMP  50.25,20.5 90 bottom
R0  24.25,17.75 180 top
R1  28.5,10.75 180 top
R2  30.5,8 90 top
R3  28.5,13 0 top
R4  14.38,6.25 270 bottom
R5  39,10.75 180 top
R6  5,30.5 90 top
R7  38.25,13 0 top
R8  54,23.75 180 bottom
R9  54.25,14.25 180 bottom
R20  45.5,18.5 270 top
R21  53,14 90 top
R22  45.5,14 90 top
R23  47.5,14 270 top
R24  50.25,13.25 0 top
R30  46.5,23.75 180 bottom
U$1  14.5,17.75 0 top
U$2  34.16,23.32 0 top
U$3  32.25,19.5 180 bottom
U$4  8,27 180 top
U$5  4,21.5 270 top
U$6  3,17.75 0 top
U$7  50.25,30.13 180 top
U$8  15.25,27.75 0 top
U$9  19.75,27.75 0 top
U$10  50.25,18.5 45 top
U$11  35,8 270 top
U$12  22,8 270 top
U$13  35,4.5 180 bottom
U$14  50.25,4.5 180 bottom
U$15  19.75,31.25 180 top
U$16  24.25,31.25 180 top
U$17  22,4.5 180 bottom
U$18  26.5,0 0 top
U$19  50.25,4.75 180 top
U$20  7.75,4.5 180 bottom
U$21  10.75,20.25 0 bottom
U$25  42.75,24.75 0 bottom
U$26  15.25,31.25 180 top
X1  10.25,3.5 0 top

### Tracks (layer width: path | path; a pad name or v marks a point on that pad's centre or on a via)
43_D0  (via drill 0.3)
  Top 0.2: U$1.24 14.25,13.04 14.22,13.06 14.22,14.97 v16,16.75
  Bottom 0.2: v16,16.75 16.75,17.5 16.75,18.75 17.25,19.25 U$21.5
43_D1  (via drill 0.3)
  Top 0.2: U$1.25 14.75,13 14.55,13.2 14.55,14.55 v16,16
  Bottom 0.2: v16,16 17.25,17.25 U$21.6
43_MISO  (via drill 0.3)
  Top 0.2: U$1.56 14.75,19.41 v13.84,18.5
  Bottom 0.2: v13.84,18.5 13.48,18.15 8.68,18.15 5.58,21.25 U$21.13
43_MOSI  (via drill 0.3)
  Top 0.2: v13.84,19.25 14.25,19.66 U$1.57 14.25,24.5 15.53,25.78 v15.73,25.78 | v16.75,28 16.75,29.75 16.5,30 16.5,30.57 U$26.8
  Bottom 0.2: v13.84,19.25 13.06,18.47 8.81,18.47 4.04,23.25 U$21.14 | v16.75,28 16.75,27 15.73,25.98 v15.73,25.78
43_NSS  (via drill 0.3)
  Top 0.2: U$1.2 8.08,21 7.5,21.58 v7.5,22
  Bottom 0.2: v7.5,22 5.75,22 4.75,23 4.75,24.5 4,25.25 U$21.15
43_RST  (via drill 0.3)
  Top 0.2: v16.75,22.25 17.5,22.25 17.75,22.5 U$1.50
  Bottom 0.2: U$21.4 17.05,21.25 16.75,21.55 v16.75,22.25
43_SCK  (via drill 0.3)
  Top 0.2: U$1.55 15.25,19.16 v13.84,17.75
  Bottom 0.2: v13.84,17.75 13.75,17.75 13.68,17.82 8.54,17.82 7.11,19.25 U$21.12
AVCC
  Top 0.2: U$1.13 7,15.5 6.35,14.85 F1.2 C6.1 C7.1
BAT  (via drill 0.3)  (1 unrouted)
  Top 0.2: R3.2 29.35,12.15 R1.1 29.35,10.18 28.75,9.58 25.96,9.58 25.7,9.32 25.7,8.15 25.7,7.75 | R7.2 39.85,12.9 R5.1 39.85,10.47 38.72,9.34 38.72,8 | 25.2,7.75 25.3,7.75 | C18.1 41.75,6.9 41.75,6.65 | 40.6,6.65 39.9,7.35 | 38.75,7.75 38.72,7.78 38.72,7.97 | 38.72,8 39.02,7.7 39.02,7.62 | 38.72,8 38.72,7.97 | 38.72,7.97 38.5,7.75
  Top 0.25: 24.85,7.75 26.45,6.15 26.45,5.1 26.8,4.75 C19.1 27.75,5.4 | 27.7,6.25 27.75,6.2 | 37.85,7.75 39.5,6.1 41.55,6.1 C25.1 | C26.1 38.8,7.15
  Top 0.3: 27.68,6.17 27.75,6.1 27.75,5.4 | 27.68,6.17 27.3,6.55 | 27.3,6.55 26.1,7.75 | U$12.14 24.85,7.75 25.2,7.75 | 25.2,7.75 25.7,7.75 26.1,7.75 | 25.8,7.15 25.2,7.75 | 25.3,7.75 25.7,8.15 26.1,7.75 | U$11.14 37.85,7.75 38.5,7.75 38.75,7.75 38.9,7.75 39.02,7.62 C26.1 | 27.75,6.2 27.73,6.17 27.68,6.17 | 25.9,7.3 26.35,7.3 C27.1 | C17.1 27.9,6.55 27.3,6.55
  Top 0.5: C17.1 28.5,7.05 27.7,6.25
  Top 0.7: 38.8,7.15 38.45,7.5 | 42.9,4.2 43.98,3.12 | 43.98,3.12 44.6,2.5 | C25.1 42.9,4.15 41.45,2.7 | 47.7,3.7 46.5,3.7 45.85,3.05 U$19.S$2 44.77,2.35 44.52,2.1 | 44.3,1.88 44.52,2.1 | 27.1,4.2 28.6,2.7 29.05,2.7 | 44.52,2.1 44.52,3.02 44.62,3.12 | 43.98,3.12 44.62,3.12 | 44.62,3.12 45.2,3.7
  Top 0.8: 27.55,1.88 27.5,1.83 27.5,1.05 25.4,1.05 | 25.4,1.05 9.7,1.05 v7.5,3.25 v6.5,3.25 | 27.1,3.45 27.1,2.75 25.4,1.05
  Top 1: v50.25,5.5 U$19.P$2 | v50.25,5.5 v50.25,3.5 | v49.25,3.5 v49.25,5.5 v50.25,5.5 | v49.25,4.5 v50.25,3.5 | v50.25,4.5 v49.25,3.5 | v49.25,3.5 v50.25,3.5 | 27.1,6.1 25.9,7.3 | C25.1 42.9,5.5 41.75,6.65 40.6,6.65 39.7,6.65 39.5,6.85 C26.1 | 27.1,2.65 27.1,1.65 27,1.55 27.22,1.55 27.55,1.88 | 29.75,1.88 29.02,1.15
  Top 1.2: C19.1 27.1,6.1
  Top 1.5: C19.1 27.1,4.2 27.1,3.45 27.1,2.65 | C25.1 42.9,4.2 42.9,1.93 42.95,1.88
  Top 2.5: 27.55,1.88 29.75,1.88 42.95,1.88 44.3,1.88 46.63,1.88 v49.25,4.5 49.5,4.75 49.55,4.75
  Bottom 0.6: 7.75,6.6 U$20.P$2
  Bottom 0.7: v6.5,3.25 6.5,5.53 7.75,6.78 U$20.P$2 | v7.5,3.25 6.6,4.15 | 53.4,14.1 R9.1
  Bottom 0.8: U$14.BAT 49.25,9.95 C28.+ | C28.+ 52.55,12.75 | C28.+ 53.4,14.1
  Bottom 1: U$14.BAT v49.25,3.5 v50.25,3.5 v50.25,5.5 49.5,5.5
BAT_BQ  (via drill 0.3)
  Top 0.2: 53.62,16.57 53.24,16.57 U$10.11 U$10.12 52.98,17.54 52.98,17.23 | C23.1 55,15.5 54.75,15.75 54,15.75
  Top 0.6: v53,15.9 53.5,15.9 53.98,15.42 v54,15.4 54,15.75 54,16.2 53.62,16.57 53,17.2 | v53,15.9 53,15.95 53.35,16.3 v53.8,16.3 | 52.5,17.7 52.98,17.23 53,17.2 | v53,15.9 53,17.2
  Bottom 0.4: 55,14.4 55.1,14.3 R9.2
  Bottom 0.6: 53.46,15.97 53,15.97
  Bottom 0.8: v54,15.4 55,14.4 | v54,15.4 54,16.1 v53.8,16.3 53.46,15.97 | v53,15.9 53.6,15.9 54,15.5 v54,15.4
BMP_SDI
  Top 0.15: U$26.7 15.65,30.36 15.38,30.08 15.38,28.49 15.79,28.07 U$8.2
BMP_SDO
  Top 0.15: U$26.6 14.85,30.35 15.1,30.1 15.1,27.16 14.71,26.77 U$8.5
DFU  (via drill 0.3)
  Top 0.2: v13.67,13.75 13.31,14.11 13.31,19.47 13.92,20.08 13.92,21.58 13.25,22.25 13.03,22.25 12.75,22.53 U$1.60 12.75,24.75 v12.88,24.87 | v13.86,10.15 13.57,10.15 11,7.58 X1.14 | U$16.6 23.85,30.15 24.43,29.57 v26.25,29.57
  Bottom 0.2: 26.1,29.42 26.4,29.42 26.82,29 BTN_DFU.P$3 | 26.1,29.42 22.05,29.42 21.44,30.03 20.99,30.03 19.58,28.62 16.29,28.62 15.98,28.31 15.98,26.84 14.01,24.87 v12.88,24.87 | v26.25,29.57 26.1,29.42 | v13.67,13.75 13.67,12.32 14.9,11.1 14.9,10.66 14.34,10.1 13.91,10.1 v13.86,10.15
EN_1  (via drill 0.3)
  Top 0.2: v13.59,9.42 13.31,9.42 11.5,7.61 X1.15 | v15.08,13.57 15.58,14.08 19.11,14.08 19.19,14 U$1.33 21.5,14 22.22,13.28 v22.22,11.25 | v20.44,10.78 20.55,10.66 U$12.5
  Bottom 0.2: v13.59,9.42 13.64,9.37 14.08,9.37 15.23,10.52 15.23,11.23 15.08,11.38 v15.08,13.57 | v20.44,10.78 20.91,11.25 v22.22,11.25
EN_2  (via drill 0.3)
  Top 0.2: v13.32,8.68 13.07,8.68 12,7.62 X1.16 | v15.08,14.32 15.16,14.4 19.15,14.4 19.25,14.5 U$1.34 21.9,14.5 22.75,13.65 U$12.1
  Bottom 0.2: v13.32,8.68 13.35,8.65 13.81,8.65 15.6,10.44 15.6,13.79 v15.08,14.32
GND  (via drill 0.3)
  Top 0.2: C4.2 v12.6,27.75 C50.2 13.28,28.07 U$8.7 | U$8.1 16.05,29.7 v15.88,29.87 | v16.75,26.25 17.65,27.15 U$9.5 | 25.1,28.35 C70.1 25.1,27.75 | U$9.11 20.35,25.64 24.25,25.64 25.1,26.49 C72.2 25.1,27.75 | v21.36,29.36 21.3,29.3 U$9.18 20.61,28.75 20.35,29.01 U$9.20 | 25.1,27.75 26.25,27.75 27.84,29.34 U$2.SHIELD@4 | U$10.22 U$10.23 | U$16.3 23.85,32.35 23.95,32.45 30.2,32.45 | v34.09,32.25 33.89,32.45 30.2,32.45 | 30.2,32.45 30.22,32.43 v30.22,32.25 | R20.1 44.6,19.35 44.35,19.1 44.35,16.25
  Top 0.25: U$1.12 7.15,16 C12.2 6.2,16.85 U$6.2 4.12,16.45 3.42,15.74 0.75,15.74 | C6.2 C7.2 1.35,13.15 0.75,13.75 0.75,15.74 | C13.2 1.1,22.35 | 1.1,22.35 0.75,22 0.75,19.25 1.35,18.65 U$6.4 1.4,18.65 0.75,18 0.75,15.74 | 1.1,22.35 0.75,22.7 0.75,24 1.25,24.5 C14.2 1.4,26.25 CBK.P$2 2.4,27 C0.2 4.9,24.35 6.25,23 C15.2 | C11.1 10.25,31.25 v9.95,30.75 | 21.9,8 U$12.17 22.1,8 | 34.9,8 U$11.17 35.1,8
  Top 0.3: C4.2 11.2,25.35 11.2,23.47 U$1.63 | 21.9,8 21.15,7.25 21.08,7.25 | 22.1,8 22.85,7.25 U$12.13 24,7.25 | 34.9,8 34.15,7.25 U$11.8 32.74,7.25 | 35.1,8 35.85,7.25 U$11.13 37.05,7.25 | U$1.18 11.25,11.27 10.73,10.75 10.25,10.75 9.75,11.25 8.93,11.25 7.9,10.21 C1.2 | v25.25,5.35 25.5,5.6 25.5,6.35 24.6,7.25 24.25,7.25 | 24,7.25 24.25,7.25 | 24,7.25 25,6.25 25.25,6.25 | 24.6,7 24.5,7 24.25,7.25 | 37.05,7.25 38,6.3 v38,4.25 | 37.05,7.25 37.6,7.25 38.5,6.35 38.5,5.35 v38.25,5.35 38.25,6.35 37.35,7.25 36.75,7.25 | C8.2 18.3,7.25 18.6,7.25 | X1.24 18.1,6.75 18.6,7.25 | X1.S$1 3.2,4.07 | 17.45,3.92 17.73,3.63 | 5.07,4.07 5.5,4.07 5.25,3.82 5.25,4.07 | 5.03,3.85 4.5,3.85 | 32.1,7.25 32.74,7.25 | 28.65,8.85 C17.2 28.55,8.9 | 30.6,10.41 v30.6,11.45 | 9.1,4.42 7.5,6.02 X1.7 7.5,7.95 | C1.2 7.9,8.62 | C1.2 7.9,8.35 | U$1.63 11.25,22.26 11.5,22 | U$1.63 11.25,22.62 12.15,21.72 12.15,20.65 v12.4,20.4 | 25,13.82 25.05,13.87 32.46,13.87 | 31,5.9 R2.1 31.65,7.95 | 32.74,7.25 32.1,7.95 | U$7.S$8 45.47,26.28 U$7.MID@2 46,25.25 | U$7.A12 46.5,24.75 | U$7.B1 47,25 | 53.5,25.25 U$7.B12 | U$7.A1 54,25.25 | 54.5,25 U$7.MID@1 55.03,26.28 U$7.S$7 | 21.08,7.25 U$12.8 18.6,7.25 | 21.08,7.25 | U$10.23 47.79,19.9 v47.79,20.19 | U$10.15 U$10.16 52.25,20.85 v52.25,21
  Top 0.4: 7.9,8.35 7.5,7.95 | v24.1,11.45 24.1,12.92 25,13.82 | U$10.4 50.25,18.15 U$10.25
  Top 0.5: C27.2 C17.2 | 28.55,8.9 29.04,8.9 | 29.7,9.6 30.15,10.05 30.25,10.05 | U$7.S$6 U$7.S$8 44.85,24.9 | U$7.S$5 U$7.S$7 55.65,24.65 | U$7.S$6 44.85,32.05 44.9,32.1 | U$7.S$6 43.93,30.13 43.7,29.9
  Top 0.6: 25.25,6.25 25.25,6.35 24.6,7 | 29.04,8.9 29.04,9.09 29.55,9.6 29.7,9.6 | 30.25,10.05 30.6,10.41 | 52.9,11.15 52.73,10.98 52.73,10.95 52.25,10.45 | 52.25,20.85 52.25,20.5 U$10.25 49.55,18.5 48,20.05
  Top 0.7: X1.S$1 3.23,3.5 4.15,4.42 9.1,4.42 13.98,4.42 14.68,3.72 17.65,3.72 17.73,3.63 X1.S$2 | R2.1 31.75,5.9 v31.75,5.35
  Top 0.8: 25.25,6.25 v25.25,5.35 25.25,4.5 v25,4.25 24.5,3.75 v24,3.75 | v38.25,5.35 38.25,4.5 v38,4.25 37.5,3.75 v37,3.75 | v31.75,5.35 31.75,4.5 v32,4.25 32.5,3.75 v33,3.75 | 28.65,8.85 30.35,7.15 R2.1 30.6,7.25 32.1,7.25 | v20,3.75 17.85,3.75 17.73,3.63 17.73,4.33 v18.75,5.35 | C19.2 29,4.75 v28.5,5.25 v28.5,4.25 28.55,4.25 29.1,4.8 | C25.2 41,4.75 41.49,5.24 41.5,5.23 v41.5,4.25 40.9,4.85 | U$19.P$1 52.25,10.45
  Top 1: U$19.P$1 52.45,8.3 53.85,8.3
  Bottom 0.2: v30.22,32.25 30.42,32.45 33.89,32.45 v34.09,32.25 | BTN_DFU.S$3 39.72,29.7 39.44,29.98
  Bottom 0.3: BTN_DFU.S$4 31.5,29.7 C16.1
  Bottom 0.5: BTN_RST.P$4 11.57,31.48 LEDD.C | U$7.S$5 U$7.S$7 55.65,26.5 | 55.65,26.5 55.65,25.1 55.75,25 | 45,32 44.85,31.85 U$7.S$6 U$7.S$8 | U$7.S$8 44.85,25.35 44.5,25 | U$7.S$8 45.25,26.5 55.65,26.5
  Bottom 0.6: C30.2 56.4,17.85 | LM3940IMP.4 51.02,23.52
  Bottom 0.8: v56.4,18.95 56.4,17.85 v56.4,16.95
  Bottom 1: 51.02,23.52 52.9,25.4 | LM3940IMP.2 LM3940IMP.4
  other vias: 52.75,20.5 53.25,21 52.75,21.5 50.75,14.75 49.75,14.75 49.25,15.5 47.3,20.72 46.79,20.19 46.34,20.74 41.5,5.25 36.5,22.7 31.7,22.7 14.5,16.6 16.2,20.3 31.7,18.5 36.6,18.5 11.2,15.1 6.2,30.6 0.5,29.3 0.5,27.3 0.5,25.3 0.5,23.3 0.5,21.3 0.5,19.3 0.5,17.3 0.5,15.2 0.5,13.2 0.5,11.2 3.75,11.2 5.25,11.2 9.75,11.2 26.6,11.45 32.7,11.45 36.95,11.45 40.95,11.45 26.5,28.1 32.1,28.1 33.6,28.1 36.45,27.8 42.75,7.5 42.75,9 42.75,15.45 42.75,13.45 42.75,11.45 56.4,24.95 56.4,22.95 56.4,20.95 47.25,5.45 46,7.05 46,8.55
  pour Top: -1.25,33.5 -1.25,-0.95 -1,-1.2 5,-1.2 5.2,-1.4 8.8,-1.4 8.8,0.1 8.7,0.2 7.4,0.2 3.99,3.61 5.25,4.88 7.75,4.88 9,3.62 16.5,3.44 16.5,7.75 18.5,9.75 46.5,9.75 47.25,10.5 51,10.5 51.25,3 50.75,2.5 49.75,2.5 47.25,0 59,0 59,33.5 58.5,34 -0.75,34
  pour Top (isolate 0.6): 16.5,4.38 2.56,4.38 4.98,-1 57.6,-1 57.6,4.55 55.86,4.59 53.15,7.3 53.15,10.5 47.25,10.5 46.5,9.75 18.5,9.75 16.5,7.75
  pour Bottom: 0.5,34.5 -1.5,32.5 -1.5,11.75 -0.25,10.5 42.25,10.5 42.75,11 42.75,18.25 59.5,18.25 59.5,33.25 58.25,34.5
  pour Bottom (isolate 0.4): -0.5,10.5 -1.75,9.25 -1.75,-0.25 -0.25,-1.75 58,-1.75 59.5,-0.25 59.5,18.5 42.5,18.5 42.5,11 42.75,10.75 42.5,10.5
GPIO_DAC
  Top 0.2: U$1.20 12.25,11.14 8.5,7.39 X1.9
GPIO_MISO
  Top 0.2: U$1.22 13.25,11.21 9.5,7.46 X1.11
GPIO_MOSI
  Top 0.2: U$1.23 13.75,11.25 10,7.5 X1.12
GPIO_SCK
  Top 0.2: U$1.21 12.75,11.18 9,7.42 X1.10
GPIO_SCL  (via drill 0.3)
  Top 0.2: U$1.30 17.25,11.3 15.25,9.3 15.25,7.96 15,7.71 X1.22 v15,4.5
  Bottom 0.2: v15,4.5 15,4.78 R4.2
GPIO_SDA
  Top 0.2: U$1.29 16.75,11.26 14.93,9.44 14.93,8.1 14.5,7.67 X1.21
GPS_RX  (via drill 0.3)
  Top 0.2: U$1.42 21.5,18.5 v21.75,18.25
  Bottom 0.2: U$3.1 23.85,13.65 22.77,14.73 22.77,16.23 21.75,17.25 v21.75,18.25
GPS_TX  (via drill 0.3)
  Top 0.2: U$1.43 21.9,19 23.15,17.75 R0.2 23.15,17.5 v22.3,17.5
  Bottom 0.2: v22.3,17.5 23.61,16.19 U$3.2
LDO
  Top 0.2: C20.2 45.5,20.73 46.99,19.24 47.74,19.24 U$10.24 47.38,18.38 44.96,18.38 44.72,18.14 44.72,17.14 45.5,16.36 R22.2
MOT_STBY  (via drill 0.3)
  Top 0.2: U$1.28 16.25,12.77 16.57,13.1 18.7,13.1 19.8,12.01 v19.8,10.25 19.8,8.46 20.01,8.25 U$12.6 | v23.28,10.75 23.25,10.78 23.25,13.75 23.75,14.25 32.61,14.25 33.6,13.27 33.6,10.3 32.75,9.45 32.75,8.75 | 32.75,8.75 32.75,8.5 33,8.25 U$11.6 | R2.2 32.65,8.85 32.75,8.75
  Bottom 0.2: v19.8,10.25 19.8,10.21 20.03,9.97 22.5,9.97 v23.28,10.75
MPU_AD0
  Top 0.2: U$15.8 21.2,30.62 22.25,29.57 22.25,28 21.8,27.55 U$9.15 20.3,27.55 19.55,26.8 U$9.9
MPU_NCS
  Top 0.2: U$9.22 19.55,29.61 20.15,30.21 U$15.7
MPU_REG
  Top 0.2: C70.2 23.4,28.65 21.9,27.15 U$9.14 20.4,27.15 19.95,26.7 U$9.10
N$1  (via drill 0.3)
  Top 0.2: U$4.1 9.2,27.73 v9.97,28.5
  Bottom 0.2: v9.97,28.5 11.17,29.7 LEDD.A
N$2  (via drill 0.3)
  Top 0.2: U$4.2 8.4,28.15 v8.75,28.5
  Bottom 0.2: v8.75,28.5 9.25,29 LEDC.A
N$3
  Bottom 0.2: R8.2 55.25,23.35 LEDCH.C
N$4  (via drill 0.3)
  Top 0.25: 32.75,6.25 33.05,6.55 U$11.9 34.25,6.25 v33,5
  Top 0.8: 33.75,6.25 33.5,6
  Top 0.9: v33,6 33.5,6
  Top 1: v33,5 v33,6
  Bottom 0.6: 32,6.25 32.75,5.5 32.75,5.25 v33,5 v33,6 | v33,6 32,7 U$13.P$1
N$5  (via drill 0.3)
  Top 0.2: U$1.62 11.75,24.92 v11.78,24.95
  Bottom 0.2: BTN_USR.P$3 18.2,29.27 16.02,29.27 15.33,28.58 15.33,27.11 14.13,25.91 12.14,25.91 11.78,25.55 v11.78,24.95
N$6  (via drill 0.3)
  Top 0.2: U$10.21 48.35,20.75 v48.25,20.75 | v48.78,21.78 48.78,22.63 C21.2
  Bottom 0.2: v48.25,20.75 v48.78,21.78
N$7  (via drill 0.3)
  Top 0.2: U$16.4 22.68,32.25 v21.85,32.25
  Bottom 0.2: v21.85,32.25 22.02,31.98 BTN_USR.P$1
N$8
  Top 0.2: U$1.47 22.4,21 C9.1
N$9
  Top 0.3: U$1.31 17.75,10.2 C8.1
N$10  (via drill 0.3)
  Top 0.2: U$10.7 51.22,15.76 v51.22,15.5
  Bottom 0.2: v51.22,15.5 51.78,16.05 51.78,18.48 54.42,21.13 54.42,22.48 R8.1
N$11
  Top 0.2: U$1.6 6.65,19 C12.1 5.4,17.75 2.77,17.75 U$6.1
N$12
  Top 0.2: U$1.5 5.57,19.5 4.72,18.65 U$6.3 3.75,18.65 C13.1
N$13
  Top 0.2: U$1.3 7.87,20.5 6.87,21.5 5.25,21.5 U$5.P$1 4,23.25 3.1,24.15 C14.1
N$14
  Top 0.2: U$5.P$2 4.4,20.65 C15.1 7.1,20.65 7.75,20 U$1.4
N$15
  Top 0.2: U$1.8 10.04,18 10.58,18.54 10.58,21.01 8,23.59 8,25.04 6.8,26.24 U$4.5
N$17
  Top 0.2: U$10.9 51.85,16.55 51.85,14 R24.2
N$18
  Top 0.2: U$10.10 52.25,16.85 52.25,15.6 R21.2
N$19
  Top 0.2: U$1.11 10.02,16.5 11.56,18.03 11.56,21.42 8.98,24 8.98,25.23 9.2,25.45 U$4.8
N$20
  Top 0.2: U$1.10 10.02,17 11.23,18.21 11.23,21.28 8.65,23.86 8.65,26.12 U$4.7
N$21
  Top 0.2: 51.3,21 51.06,20.76 U$10.18 50.7,20.71 51.01,20.41 U$10.17 51.07,20.43 | C21.1 51.1,22.4 51.38,22.12 | 51.38,22.12 51.7,21.8 | 51.38,22.12 51.38,21.48 51.15,21.25 | 52.08,22.18 52.02,22.12 51.38,22.12
  Top 0.3: 51.07,20.43 51.3,20.66 51.3,20.87 51.09,20.66 50.89,20.66 50.79,20.76 | 51.3,21 51.15,21
  Top 0.6: 53.5,22.7 L2.P$1
  Top 0.7: 51.15,21 51.15,21.25 51.7,21.8 52.08,22.18 52.6,22.7 53.5,22.7
N$22
  Bottom 0.2: LEDP.C 45.25,23.35 R30.1
N$23  (via drill 0.3)
  Top 0.25: 34.75,6 34.75,5.2 34.25,4.7 v34.25,4 | U$11.10 34.75,6.05 33.85,5.15 33.85,3.95 | v34.25,5 34.25,5.2
  Top 0.27: U$11.10 34.75,6
  Top 0.4: 34.6,5.55 34.25,5.2
  Top 1: v34.25,4 v34.25,5
  Bottom 0.6: 33.8,6.6 33.8,4.45 v34.25,4 v34.25,5 34.25,7.6 U$13.P$2
N$24
  Top 0.2: U$10.20 48.16,21.65 C22.1
N$25  (via drill 0.3)
  Top 0.2: U$16.7 24.65,30.95 24.9,31.2 v26.85,31.2
  Bottom 0.2: v26.85,31.2 26.07,31.98 BTN_USR1.P$4
N$26
  Top 0.2: U$1.9 10.02,17.5 10.9,18.38 10.9,21.15 8.32,23.73 8.32,25.43 7.6,26.15 U$4.6
N$27
  Top 0.2: U$10.1 47.63,17.65 R20.2
N$28  (via drill 0.3)
  Top 0.2: U$1.61 12.25,24.42 12.3,24.48 12.3,25.33 v12.36,25.39
  Bottom 0.2: BTN_USR1.P$3 24.7,30.52 23.93,29.75 22.18,29.75 21.58,30.35 20.85,30.35 19.45,28.95 16.16,28.95 15.65,28.44 15.65,26.98 14.21,25.54 14.15,25.48 14.07,25.4 12.66,25.4 12.65,25.39 v12.36,25.39
N$29  (via drill 0.3)
  Top 0.25: v35.75,4 35.75,4.7 35.25,5.2 U$11.11 35.25,6.05 36.15,5.15 36.15,3.95 | v35.75,5 35.5,5.25
  Top 0.27: U$11.11 35.25,6
  Top 0.6: 35.5,5.5 35.5,5.25
  Top 1: v35.75,4 v35.75,5
  Bottom 0.6: 36.2,7.2 36.2,4.45 v35.75,4 v35.75,5 35.75,7.6 U$13.P$3
N$30  (via drill 0.3)
  Top 0.25: 37.25,6.25 36.95,6.55 U$11.12 35.75,6.2 36.95,5 v37,5 37,5.25 36.4,5.85 36.4,5.9 | v37,6 36.9,6 36.65,6.25
  Top 0.8: 36.65,6.25 36.15,6.25
  Top 1: v37,5 v37,6
  Bottom 0.6: 38,6.25 37.25,5.5 37.25,5.25 v37,5 v37,6 38,7 U$13.P$4
N$31  (via drill 0.3)
  Top 0.25: 19.75,6.25 20.05,6.55 U$12.9 21.25,6.25 v20,5
  Top 0.8: 20.8,6.25 20.6,6.05 20.05,6.05 v20,6
  Top 1: v20,5 v20,6
  Bottom 0.6: 19,6.25 19.75,5.5 19.75,5.25 v20,5 v20,6 | v20,6 19,7 U$17.P$1 | v20,6
N$33  (via drill 0.3)
  Top 0.25: 21.75,6.15 20.85,5.25 20.85,3.95 | U$12.10 21.75,5.2 21.55,5 v21.25,5 21.25,5.25
  Top 0.27: U$12.10 21.75,6.15
  Top 0.4: 21.25,5.25 21.65,5.65
  Top 1: v21.25,4 v21.25,5
  Bottom 0.6: 20.8,6.8 20.8,4.45 v21.25,4 v21.25,5 21.25,7.6 U$17.P$2
N$34  (via drill 0.3)
  Top 0.25: 23.15,3.95 23.15,5.22 22.25,6.12 22.25,5.2 22.75,4.7 v22.75,4 | v22.75,5 22.75,5.25
  Top 0.27: U$12.11 22.25,6.12
  Top 0.5: 22.75,5.25 22.4,5.6
  Top 1: v22.75,4 v22.75,5
  Bottom 0.6: 23.2,6.6 23.2,4.45 v22.75,4 v22.75,5 22.75,7.6 U$17.P$3
N$35  (via drill 0.3)
  Top 0.25: 24.25,6.25 23.95,6.55 23.5,6.55 | 23.5,6.55 U$12.12 22.75,6.25 v24,5 | 23.5,6.55 23.75,6.3 23.75,5.75
  Top 0.3: 23.2,6.3 23,6.3
  Top 0.7: 23.75,5.75 23.2,6.3
  Top 1: v24,5 v24,6
  Bottom 0.6: 25,6.25 24.25,5.5 24.25,5.25 v24,5 v24,6 25,7 U$17.P$4
N$36
  Top 0.2: U$12.16 24.21,8.75 26.21,10.75 R1.2
N$37  (via drill 0.3)
  Top 0.2: v7.75,28.5 7.6,28.35 U$4.3
  Bottom 0.2: LEDB.A 7.25,29 v7.75,28.5
N$38  (via drill 0.3)
  Top 0.2: U$4.4 6.8,28.2 v6.5,28.5
  Bottom 0.2: v6.5,28.5 5.3,29.7 LEDA.A
N$39
  Top 0.2: U$12.15 24.17,8.25 25.82,9.9 28.25,9.9 28.5,10.15 R3.1
N$40
  Top 0.2: R5.2 38.15,9.69 37.21,8.75 U$11.16
N$41
  Top 0.2: R6.2 D1.2
N$42
  Top 0.2: R7.1 39,12.25 39,10.08 37.17,8.25 U$11.15
NRST  (via drill 0.3)
  Top 0.2: v10.05,20 10.05,19.03 9.52,18.5 U$1.7 | C11.2 13.22,30.62 U$26.5 14.05,30.03 14.58,29.5 v14.6,29.5 | v12.75,21.75 13.1,21.75 13.6,21.25 13.6,20.22 12.98,19.6 12.98,13.34 v13.06,13.27 | v14.12,10.88 13.84,10.88 10.5,7.54 X1.13
  Bottom 0.127: BTN_RST.P$2 17.46,30.02 18.67,31.24 26.23,31.24 26.36,31.11 26.36,31 26.65,30.71 27.05,30.71 27.58,31.24 30.44,31.24 30.67,31.01 31.41,31.01 31.89,30.53 34.46,30.53 34.95,30.04 36.47,30.04 36.96,29.55 36.96,28.04 38.56,26.44 38.56,19.35 39.18,18.73 U$3.10
  Bottom 0.2: v12.75,21.75 11.8,21.75 v10.05,20 9.52,20.53 9.52,20.97 9.72,21.17 9.72,23.95 12.01,26.24 13.99,26.24 14.6,26.85 v14.6,29.5 14.1,29.5 13.57,30.02 BTN_RST.P$3 | v13.06,13.27 13.06,12.44 14.12,11.38 v14.12,10.88
NTC  (via drill 0.3)
  Top 0.2: R22.1 R23.2 49.3,13.15 R24.1 51.4,11.25 v52,11.25
  Bottom 0.2: v52,11.25 52,11.1 51.25,10.35 U$14.NTC
P_EN_3
  Top 0.2: U$1.35 22.11,15 22.51,14.61 32.72,14.61 33.92,13.4 33.92,10.16 33.55,9.8 U$11.5
P_EN_4  (via drill 0.3)
  Top 0.2: U$1.36 22.07,15.5 22.64,14.93 32.86,14.93 34.47,13.31 v34.47,11.8 | U$11.1 35.75,10.2 36.12,10.57 36.12,11.13 35.87,11.38 v35.87,11.63
  Bottom 0.2: v35.87,11.63 34.65,11.63 v34.47,11.8
PWM_1  (via drill 0.3)
  Top 0.2: X1.20 14,7.64 14.6,8.23 14.6,9.57 15.75,10.72 U$1.27 15.75,13 16.17,13.42 18.84,13.42 19.29,12.97 20.47,12.97 21.17,12.28 v21.17,10.66 | U$12.2 22.25,10.47 v22.22,10.5
  Bottom 0.2: v21.17,10.66 v22.22,10.5
PWM_2
  Top 0.2: X1.19 13.5,7.6 14.27,8.37 14.27,9.71 15.25,10.69 U$1.26 15.25,13 16,13.75 18.98,13.75 19.34,13.38 21.12,13.38 21.7,12.8 21.7,10.45 21.25,10 U$12.4
PWM_3
  Top 0.2: U$1.37 22.04,16 22.78,15.26 33.06,15.26 35,13.32 35,10.45 35.25,10.2 U$11.2
PWM_4  (via drill 0.3)
  Top 0.2: U$1.38 22,16.5 22.91,15.59 33.21,15.59 35.33,13.47 35.33,11.25 35.6,10.98 v35.6,10.9 | v34.47,11 34.25,10.78 U$11.4
  Bottom 0.2: v35.6,10.9 35.5,11 v34.47,11
SCL
  Top 0.2: U$1.58 13.75,24.54 15.99,26.77 U$8.4 16.3,27.02 16.98,27.02 17.91,27.95 U$9.3 18.59,27.95 19.15,28.51 U$9.23 19.15,30.5 19.28,30.62 U$15.6
SD_CLK
  Top 0.2: U$1.53 16.25,22.67 16,22.42 16,22 16.28,21.72 17.75,21.72 20.03,24.01 26.29,24.01 29.71,27.42 35.13,27.42 36.18,28.47 U$2.CLK
SD_CMD
  Top 0.2: U$1.54 15.75,24.5 16.4,25.15 19.32,25.15 19.48,25.32 25.75,25.32 29.25,28.82 29.25,29.75 30.08,30.58 33.42,30.58 33.98,30.02 U$2.CMD
SD_D0
  Top 0.2: U$1.39 19,17 17.92,18.08 17.92,21.44 20.17,23.68 26.43,23.68 29.84,27.1 37.1,27.1 38.38,28.38 U$2.D0
SD_D1
  Top 0.2: U$1.40 19,17.5 18.25,18.25 18.25,21.3 20.3,23.35 26.56,23.35 29.98,26.77 37.77,26.77 39.48,28.48 U$2.D1
SD_D2
  Top 0.2: U$1.51 17.25,24.25 17.5,24.5 19.59,24.5 19.75,24.66 26.02,24.66 30.33,28.97 31.43,28.97 U$2.D2
SD_D3  (via drill 0.3)
  Top 0.2: U$1.52 16.75,24.46 17.11,24.83 19.45,24.83 19.61,24.99 25.89,24.99 30.25,29.35 | 30.25,29.35 30.25,29.55 v29.83,29.55 | 30.25,29.35 31.15,30.25 32.5,30.25 32.88,29.87 U$2.D3 | v27.9,30.72 27.8,30.62 U$16.8
  Bottom 0.2: v27.9,30.72 27.9,30.02 28.37,29.55 v29.83,29.55
SD_SW
  Top 0.2: U$1.41 21,18 23.09,15.91 33.39,15.91 U$2.SW1
SDA
  Top 0.2: U$1.59 13.25,24.5 15.5,26.75 15.5,27.07 15.85,27.43 U$8.3 16.93,27.43 17.85,28.35 U$9.2 18.49,28.35 18.75,28.61 18.75,28.89 | U$15.5 18.75,30.43 U$9.24 18.75,28.89 | 18.75,28.89
SWCLK  (via drill 0.3)
  Top 0.2: U$1.49 18.98,23.42 19.9,24.34 26.16,24.34 30.02,28.2 v30.8,28.2 | U$25.P$3 42,26.02 41.91,26.11 30.78,26.11 v30.58,25.91
  Bottom 0.2: v30.8,28.2 30.8,27.95 v30.58,25.91
SWDIO
  Top 0.2: U$1.46 19.25,20.5 18.83,20.92 18.83,21.42 20.44,23.03 26.7,23.03 30.11,26.44 41.25,26.44 43.47,28.66 U$25.P$2
UART2_RX  (via drill 0.3)
  Top 0.2: U$1.17 9.23,12.08 7,9.85 X1.6 7,5.4 7.2,5.2 v7.32,5.2
  Bottom 0.2: v7.32,5.2 7.4,5.12 8.09,5.12 9.75,6.78 U$20.P$3
UART2_TX  (via drill 0.3)
  Top 0.2: U$1.16 8.83,12.14 6.5,9.81 X1.5 6.5,6 v5.7,5.2 | v6.91,2.09 8.7,0.3 47.55,0.3 49.75,2.5 50.75,2.5 51.25,3 51.25,10 51,10.25 48.5,10.25 48.25,10 U$19.P$3
  Bottom 0.2: v5.7,5.2 5.7,2.98 6.59,2.09 v6.91,2.09
UART4_RX
  Top 0.2: U$1.15 8,14.5 7.75,14.25 7.75,13.75 8.5,13 8.5,12.28 6,9.77 X1.4
UART4_TX
  Top 0.2: X1.3 5.5,9.74 8.18,12.41 8.18,12.86 7.42,13.62 7.42,14.38 8.04,15 U$1.14
USB_D+  (via drill 0.3)
  Top 0.2: U$1.45 21.82,20 22.75,19.08 25.58,19.08 26,19.5 26,20.99 29.8,24.79 41.44,24.79 U$25.P$4 42.75,22.62 43.69,21.68 43.69,20.58 44.02,20.25 44.02,17.55 43.76,17.3 v43.76,17.01 | U$10.2 47.81,17.12 v46.52,17.12 | U$7.B6 50,25.61 v49.79,25.4 | v51.5,25.4 51.46,25.4 51,25.86 U$7.A6
  Bottom 0.2: v46.52,17.12 46.37,17.26 44.01,17.26 v43.76,17.01 | v51.5,25.4 50.97,25.93 49.75,25.93 | 49.75,25.93 46.1,25.93 43.65,23.48 U$25.P$4 | v49.79,25.4 49.75,25.44 49.75,25.93
USB_D-  (via drill 0.3)
  Top 0.2: U$1.44 21.86,19.5 22.61,18.75 25.71,18.75 26.33,19.36 26.33,20.85 29.93,24.46 40.44,24.46 42.75,22.15 U$25.P$5 43.69,20 43.69,17.79 v42.95,17.05 | U$10.3 47.9,16.5 46.11,16.5 v45.89,16.72 | v49,25.4 49.04,25.4 49.5,25.86 U$7.A7 | U$7.B7 50.5,25.61 v50.71,25.4
  Bottom 0.2: v45.89,16.72 45.64,16.47 43.49,16.47 42.95,17.01 v42.95,17.05 | v50.71,25.4 50.18,24.88 49,24.88 | U$25.P$5 42.75,22.12 45.51,24.88 49,24.88 | v49,25.4 49,24.88
USB_VBUS
  Top 0.2: 49.56,21.52 49.6,21.48 49.6,21.3 | U$10.19 49.8,20.8 49.9,20.8
  Top 0.3: U$7.B4 48,25.7 47.75,25.45 47.5,25.7 U$7.A9 | U$7.B9 52.5,25.7 52.75,25.45 53,25.7 U$7.A4 | 49.56,21 49.56,21.52
  Top 0.4: 50.25,23.83 50.25,24.53 50.3,24.58 | 51,24.58 50.25,23.83 | 50.25,23.83 49.5,24.58 | 50.25,23.83 50.25,22.55 | 50.25,22.55 49.87,22.17 | 49.87,22.17 49.6,21.9 49.6,21.3 | 49.9,20.8 50.25,21.15 50.25,22.55 | 49.87,22.17 49.87,20.9
  Top 0.8: 47.75,25.45 47.75,25.05 48.22,24.58 49.5,24.58 50.3,24.58 51,24.58 52.38,24.58 52.75,24.95 52.75,25.45
VBACKUP  (via drill 0.3)
  Top 0.2: v10.05,20.75 10.05,21.08 9.63,21.5 U$1.1 8.75,21.58 8.75,22.13 6.6,24.28 C0.1 4.6,26.5 CBK.P$1 4.6,29.25 R6.1
  Bottom 0.2: v10.05,20.75 10.05,23.75 10.65,24.35 13.95,24.35 14.83,25.23 15.87,25.23 16.87,24.23 20.66,24.23 20.81,24.38 23.12,24.38 23.69,23.81 U$3.5
VCC  (via drill 0.3)
  Top 0.2: U$1.48 20.85,21.5 21.4,21.5 | 21.4,21.5 22.65,21.5 C3.1 | v15.21,24.7 15.26,24.75 15.54,24.75 16.27,25.48 18.71,25.48 19.15,25.92 U$9.8 | C72.1 23.5,26.85 | 23.05,30.45 U$16.5 23.09,30.69 | 10.15,29.5 10,29.65 C80.1 D1.1 | 21.05,22 21.05,21.85 21.4,21.5 | U$8.6 13.68,27.43 v13.65,27.4 | 14.38,28.8 U$8.8 14.43,28.75 v13.65,28.75 13.65,28.97 13.02,29.6 11.75,29.6
  Top 0.25: C50.1 10.15,29.5 | U$9.1 17.75,28.75 17.5,29 17.5,31.88 | U$9.13 C72.1 24.25,27.6 24.25,29.25 23.05,30.45
  Top 0.27: v18.95,10.15 18.25,10.85 U$1.32
  Top 0.3: X1.8 8,7.44 8.23,7.68 8.26,7.68 10.68,10.1 | 10.68,10.1 11.75,11.17 U$1.19 11.75,12.92 12,13.17 | C1.1 10.68,10.1 | X1.2 5,10 6.25,11.25 F1.1 7.14,13.15 v7.65,12.65 | v20.8,22.5 20.8,22.25 21.05,22 21.05,21.7 20.85,21.5 | U$1.64 10.75,26.6 C4.1 C50.1 11.75,29.6 11.75,31.74 12.09,32.08 13.85,32.08 U$26.4 U$26.3 U$26.2 U$26.1 17.5,31.88 U$15.4 U$15.3 U$15.2 U$15.1 21.01,31.88 21.66,31.22 22.45,31.22 U$16.5 23.05,30.8 23.5,31.25 24.34,31.25 24.65,31.56 U$16.2 U$16.1 28.05,31.88 28.75,31.18 34,31.18 34,30.87 35.08,29.79 U$2.VCC | v13.06,7.94 12.99,7.94 12.5,7.44 X1.17 | v18.95,10.15 18.8,10 18.8,9.88 18.07,9.15 17.7,9.15 17.01,9.85 16.33,9.85 15.63,9.14 15.63,7.81 15.5,7.68 X1.23 | 34.12,31.3 v34.26,31.17
  Top 0.4: v12,13.5 12,13.17 | v41.45,30.7 40.5,31.65 34.48,31.65 34.12,31.3 34,31.18
  Top 0.9: U$25.P$6 42.75,19.1 41.2,20.65 27.4,20.65 v27.15,20.4 | v27.15,20.4 v27.6,21.15 27.63,21.15 28.55,20.7 | v28.1,20.4 v27.15,20.4
  Bottom 0.2: U$21.3 16.66,23.25 v15.21,24.7 | 14.38,7.25 R4.1 14.38,7.27 13.71,7.94 | LEDP.A 45.25,18.49 45,18.24 | C71.1 21.35,23.25 21,23.25 | 21,23.25 20.35,23.25 | 21,23.25 20.68,22.93 | 20.8,22.8 v20.8,22.5 | v13.65,27.4 v13.65,28.75 | BTN_DFU.P$2 37.5,29.85 35.83,31.52 34.61,31.52 v34.26,31.17
  Bottom 0.3: v12,13.5 8.5,13.5 v7.65,12.65 | v34.26,31.17 34.06,31.17 33.77,30.87 32.03,30.87 C16.2
  Bottom 0.4: U$25.P$6 42.75,18.54 41.71,19.58 41.71,30.44 v41.45,30.7 | v12,13.5 13.6,15.1 15.3,15.1 16.2,14.2 16.2,11.77 16.87,11.1 | v13.06,7.94 13.71,7.94 16.87,11.1 | 16.87,11.1 C32.1 | v18.95,10.15 19,10.2 19,10.6 | 19,11.1 19,10.6 | 19.5,11.1 19,10.6 | 19,10.6 18.5,11.1
  Bottom 0.6: C5.2 20.7,20.8 20.7,12.3 19.5,11.1 19,11.1 18.5,11.1 C32.1 | LM3940IMP.3 47.95,16.95 45.5,14.5 C31.1
  Bottom 0.8: U$3.4 22.63,21.27 22.05,21.85 C5.2 20.8,22.8 20.68,22.93 20.35,23.25 U$21.3
  Bottom 0.9: 26.23,21.27 27.1,20.4 v28.1,20.4 v27.6,21.15 27.48,21.27 26.23,21.27 | U$3.4 26.23,21.27
  Bottom 1: 23.75,21.27 U$3.4 | LM3940IMP.3 47.19,18.24 45,18.24 42.77,18.24 U$25.P$6
VSYS  (via drill 0.3)
  Top 0.2: 53.75,19.58 52.41,19.58 U$10.14 52.16,19.25 52.41,18.99 U$10.13 52.51,19.19 | 54.15,19.35 v54,19.5 | 54.85,20.3 55.45,19.7
  Top 0.6: v54,19.5 v54,18.7 | v54,18.7 53.8,18.7 53.31,19.19 52.51,19.19 | 54.65,19.35 v54,18.7
  Top 0.7: C24.1 55,20.45 | 55,20.45 55,21.8 L2.P$2 | C24.1 53.47,19.35 53.31,19.19 | 55,20.45 54.85,20.3 54.05,19.5 v54,19.5 | C24.1 54.65,19.35
  Bottom 0.2: LEDCH.A 54.2,19.7 v54,19.5
  Bottom 0.5: U$14.AUX 53.25,11.19 54.61,12.55 55.5,12.55 56.25,13.3 56.25,15.25 55.35,16.15 C30.1
  Bottom 0.6: 55,16.15 C30.1 53.92,17.48 LM3940IMP.1 52.55,17.8 | v53.3,19.1 v54,18.7 53.45,18.7 52.55,17.8 | 54,18.75 v54,19.5 53.7,19.5 v53.3,19.1 | 52.55,17.8 52.55,18.35 v53.3,19.1

### Text on the board
tPlace: L=4, H=2 channels | OPPO / FLEX! | SobieskiSat / Prototype3 | European / CanSat / Competiton
bPlace: JLCJLCJLCJLC | VSYS
tTest: VSYS | GND | GND | 4 | 1 | 5 | 2 | 3 | 6 | 7 | VCC | GND | VSYS
bTest: GND | DIO | VCC | CLK | VSYS | GND | 4 | 5 | 6 | 7 | GND | VSYS